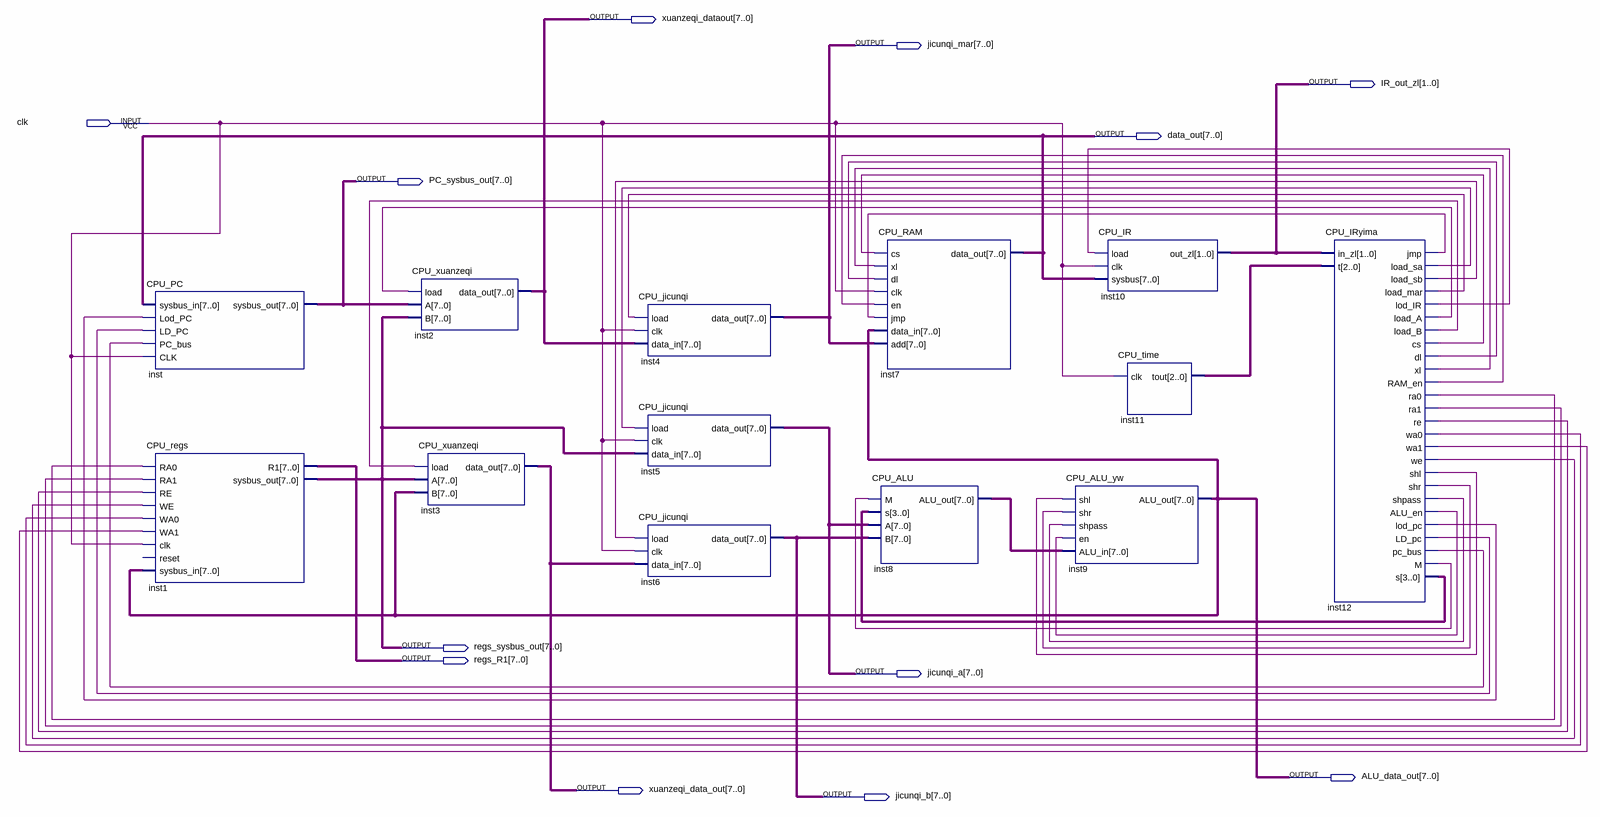
[diagram p0: schematic sheet]
// Quartus schematic CPU.bdf as structural Verilog: 13 symbols, 12 pins
module CPU (
  input  clk,
  output [7:0] xuanzeqi_dataout,
  output [7:0] jicunqi_mar,
  output [1:0] IR_out_zl,
  output [7:0] data_out,
  output [7:0] PC_sysbus_out,
  output [7:0] regs_sysbus_out,
  output [7:0] regs_R1,
  output [7:0] jicunqi_a,
  output [7:0] ALU_data_out,
  output [7:0] xuanzeqi_data_out,
  output [7:0] jicunqi_b
);

  wire inst12_alu_en, inst12_cs, inst12_dl, inst12_jmp, inst12_ld_pc, inst12_load_a, inst12_load_b,
       inst12_load_mar, inst12_load_sa, inst12_load_sb, inst12_lod_ir, inst12_lod_pc, inst12_m,
       inst12_pc_bus, inst12_ra0, inst12_ra1, inst12_ram_en, inst12_re, inst12_shl, inst12_shpass,
       inst12_shr, inst12_wa0, inst12_wa1, inst12_we, inst12_xl;
  wire [2:0] inst11_tout;
  wire [3:0] inst12_s;
  wire [7:0] inst8_alu_out;

  CPU_PC inst (
    .sysbus_in(data_out), .Lod_PC(inst12_lod_pc), .LD_PC(inst12_ld_pc), .PC_bus(inst12_pc_bus), .CLK(clk),
    .sysbus_out(PC_sysbus_out));
  CPU_regs inst1 (
    .RA0(inst12_ra0), .RA1(inst12_ra1), .RE(inst12_re), .WE(inst12_we), .WA0(inst12_wa0), .WA1(inst12_wa1),
    .clk(clk), .sysbus_in(ALU_data_out), .R1(regs_R1), .sysbus_out(regs_sysbus_out));  // open: reset
  CPU_xuanzeqi inst2 (.load(inst12_load_a), .A(PC_sysbus_out), .B(regs_sysbus_out), .data_out(xuanzeqi_dataout));
  CPU_xuanzeqi inst3 (.load(inst12_load_b), .A(regs_sysbus_out), .B(ALU_data_out), .data_out(xuanzeqi_data_out));
  CPU_jicunqi inst4 (.load(inst12_load_mar), .clk(clk), .data_in(xuanzeqi_dataout), .data_out(jicunqi_mar));
  CPU_jicunqi inst5 (.load(inst12_load_sa), .clk(clk), .data_in(regs_sysbus_out), .data_out(jicunqi_a));
  CPU_jicunqi inst6 (.load(inst12_load_sb), .clk(clk), .data_in(xuanzeqi_data_out), .data_out(jicunqi_b));
  CPU_RAM inst7 (
    .cs(inst12_cs), .xl(inst12_xl), .dl(inst12_dl), .clk(clk), .en(inst12_ram_en), .jmp(inst12_jmp),
    .data_in(ALU_data_out), .add(jicunqi_mar), .data_out(data_out));
  CPU_ALU inst8 (.M(inst12_m), .s(inst12_s), .A(jicunqi_a), .B(jicunqi_b), .ALU_out(inst8_alu_out));
  CPU_IR inst10 (.load(inst12_lod_ir), .clk(clk), .sysbus(data_out), .out_zl(IR_out_zl));
  CPU_ALU_yw inst9 (
    .shl(inst12_shl), .shr(inst12_shr), .shpass(inst12_shpass), .en(inst12_alu_en), .ALU_in(inst8_alu_out),
    .ALU_out(ALU_data_out));
  CPU_time inst11 (.clk(clk), .tout(inst11_tout));
  CPU_IRyima inst12 (
    .in_zl(IR_out_zl), .t(inst11_tout), .jmp(inst12_jmp), .load_sa(inst12_load_sa), .load_sb(inst12_load_sb),
    .load_mar(inst12_load_mar), .lod_IR(inst12_lod_ir), .load_A(inst12_load_a), .load_B(inst12_load_b),
    .cs(inst12_cs), .dl(inst12_dl), .xl(inst12_xl), .RAM_en(inst12_ram_en), .ra0(inst12_ra0),
    .ra1(inst12_ra1), .re(inst12_re), .wa0(inst12_wa0), .wa1(inst12_wa1), .we(inst12_we), .shl(inst12_shl),
    .shr(inst12_shr), .shpass(inst12_shpass), .ALU_en(inst12_alu_en), .lod_pc(inst12_lod_pc),
    .LD_pc(inst12_ld_pc), .pc_bus(inst12_pc_bus), .M(inst12_m), .s(inst12_s));
endmodule
